# Altium schematic sheet 06.SchDoc
size 297 x 209 mm
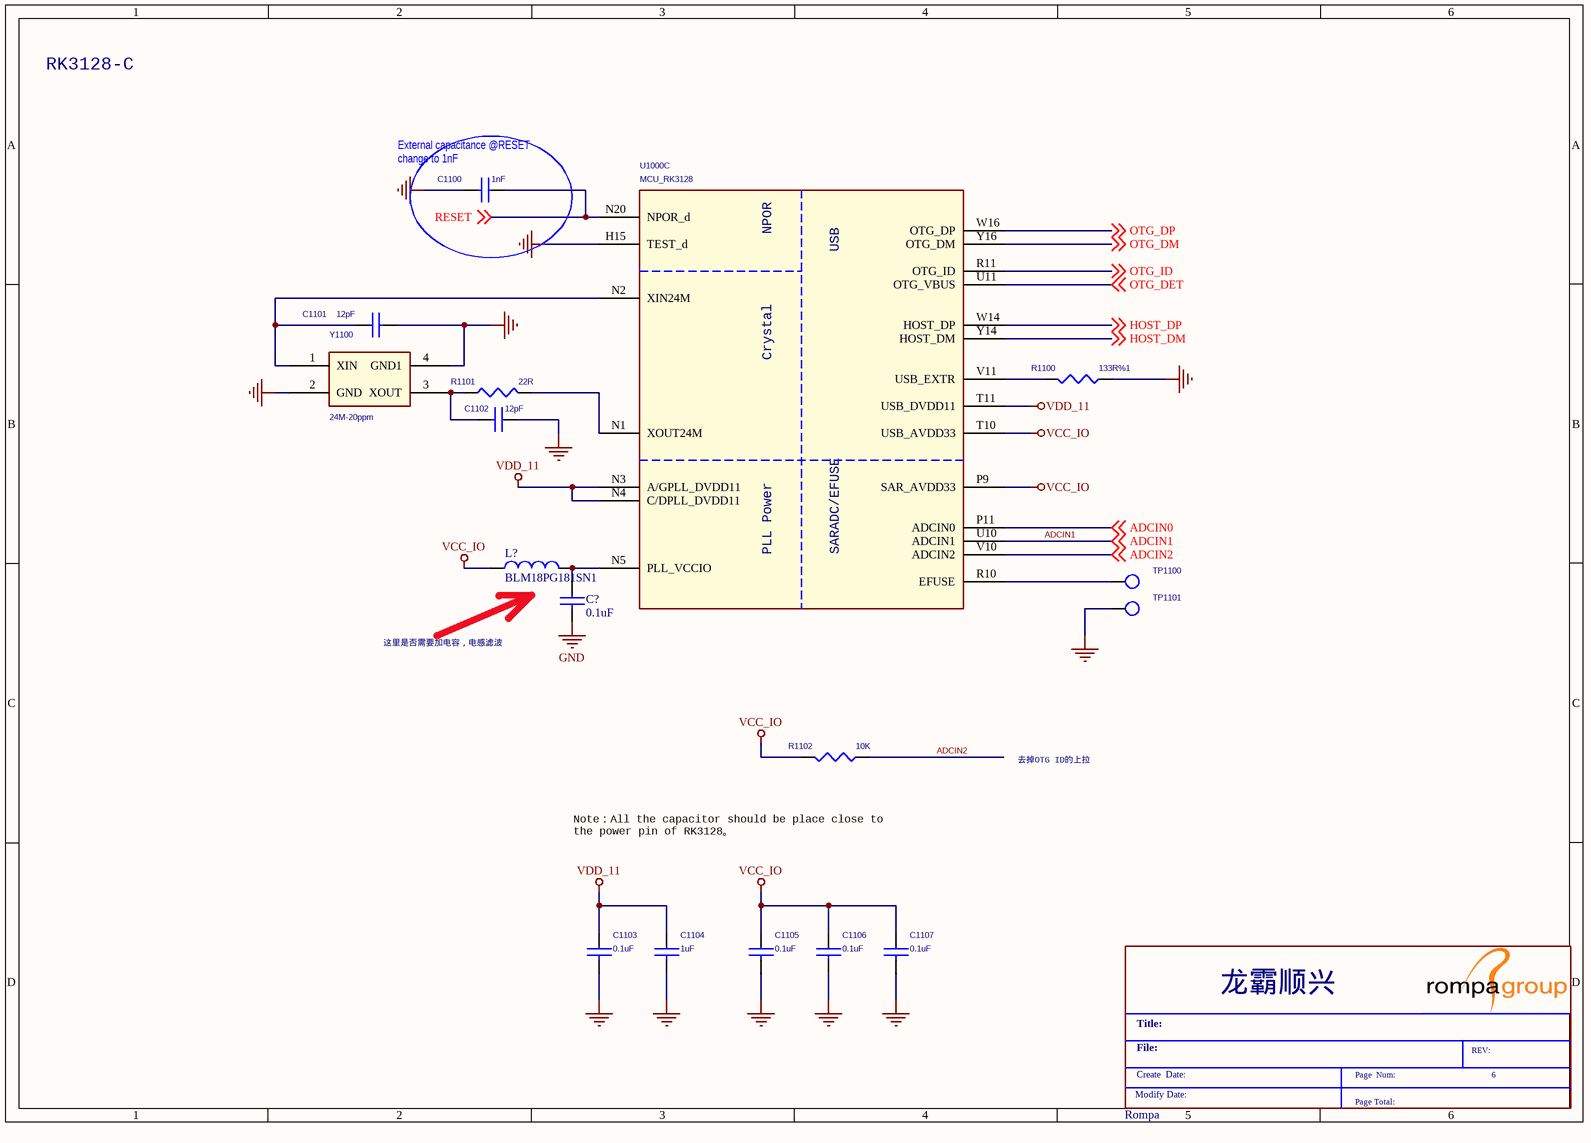
[diagram p0: 06.SchDoc]

## Parts
*  Rompa  Schematic Page Number: 6  (graphical)
C1100  1nF  [C0402]
C1101  12pF  [C0402]
C1102  12pF  [C0402]
C1103  0.1uF  [C0402]
C1104  1uF  [C0402]
C1105  0.1uF  [C0402]
C1106  0.1uF  [C0402]
C1107  0.1uF  [C0402]
C?  0.1uF  [C0402]
L?  BLM18PG181SN1  [L0603]
R1100  133R%1  [R0402]
R1101  22R  [R0402]
R1102  10K  [R0402]
TP1100  TEST  [TEST]  (value not drawn)
TP1101  TEST  [TEST]  (value not drawn)
U1000  MCU_RK3128  [BGA316-14X14-0.65]  (part C of 12)
Y1100  24M-20ppm  [CRY-3225]

## Nets
GND: C1100.2 C1101.2 C1102.1 C1103.2 C1104.2 C1105.2 C1106.2 C1107.2 C?.2 R1100.1 TP1101.1 U1000.H15(TEST_d) Y1100.2(GND) Y1100.4(GND1)
VCC_IO: C1105.1 C1106.1 C1107.1 L?.1 R1102.2 U1000.P9(SAR_AVDD33) U1000.T10(USB_AVDD33)
VDD_11: C1103.1 C1104.1 U1000.N3(A/GPLL_DVDD11) U1000.N4(C/DPLL_DVDD11) U1000.T11(USB_DVDD11)
ADCIN0: U1000.P11(ADCIN0) ; off-sheet ADCIN0
ADCIN1: U1000.U10(ADCIN1) ; off-sheet ADCIN1
ADCIN2: R1102.1 U1000.V10(ADCIN2) ; off-sheet ADCIN2
HOST_DM: U1000.Y14(HOST_DM) ; off-sheet HOST_DM
HOST_DP: U1000.W14(HOST_DP) ; off-sheet HOST_DP
OTG_DET: U1000.U11(OTG_VBUS) ; off-sheet OTG_DET
OTG_DM: U1000.Y16(OTG_DM) ; off-sheet OTG_DM
OTG_DP: U1000.W16(OTG_DP) ; off-sheet OTG_DP
OTG_ID: U1000.R11(OTG_ID) ; off-sheet OTG_ID
RESET: C1100.1 U1000.N20(NPOR_d) ; off-sheet RESET
NetC1101_1: C1101.1 U1000.N2(XIN24M) Y1100.1(XIN)
NetC1102_2: C1102.2 R1101.1 Y1100.3(XOUT)
NetC?_1: C?.1 L?.2 U1000.N5(PLL_VCCIO)
NetR1100_2: R1100.2 U1000.V11(USB_EXTR)
NetR1101_2: R1101.2 U1000.N1(XOUT24M)
NetTP1100_1: TP1100.1 U1000.R10(EFUSE)

## Notes on the sheet
- RK3128-C
- (near C1100) External capacitance @RESET
  change to 1nF
- 这里是否需要加电容，电感滤波
- 去掉OTG ID的上拉
- Note：All the capacitor should be place close to
  the power pin of RK3128。
- (in symbol MCU_RK3128, part C) NPOR; USB; Crystal; PLL Power; SARADC/EFUSE
- (in symbol Rompa) 龙霸顺兴; Title:; File:; REV:; Create  Date:; Page  Num:; Modify Date:; Page Total:

## Library data of the parts
C1100 = CAP NP: RoHS CHIP CAP 1nF +10/-10% X5R
C1101 C1102 C? = CAP NP
C1103-C1107 = CAP NP: RoHS CHIP CAP 0.1uF +10/-10% X7R
L? = Inductor: FERRITE BEAD 180 OHM 0603 1LN; Code_IEC: 1005; Published: 8-Jun-2000; LatestRevisionDate: 17-Jul-2002; LatestRevisionNote: Re-released for DXP Platform.; PackageReference: 0402-A; Publisher: Altium Limited; Code_JEITA: 0402
R1100 = RES 1B: ROHS CHIP RES 43.2R 1/16W 1%
R1101 R1102 = RES 1B
TP1100 TP1101 = TESTPOINT1_0
Y1100 = CRYSTAL-4_0